# EAGLE schematic rom (EAGLE 6.5.0)
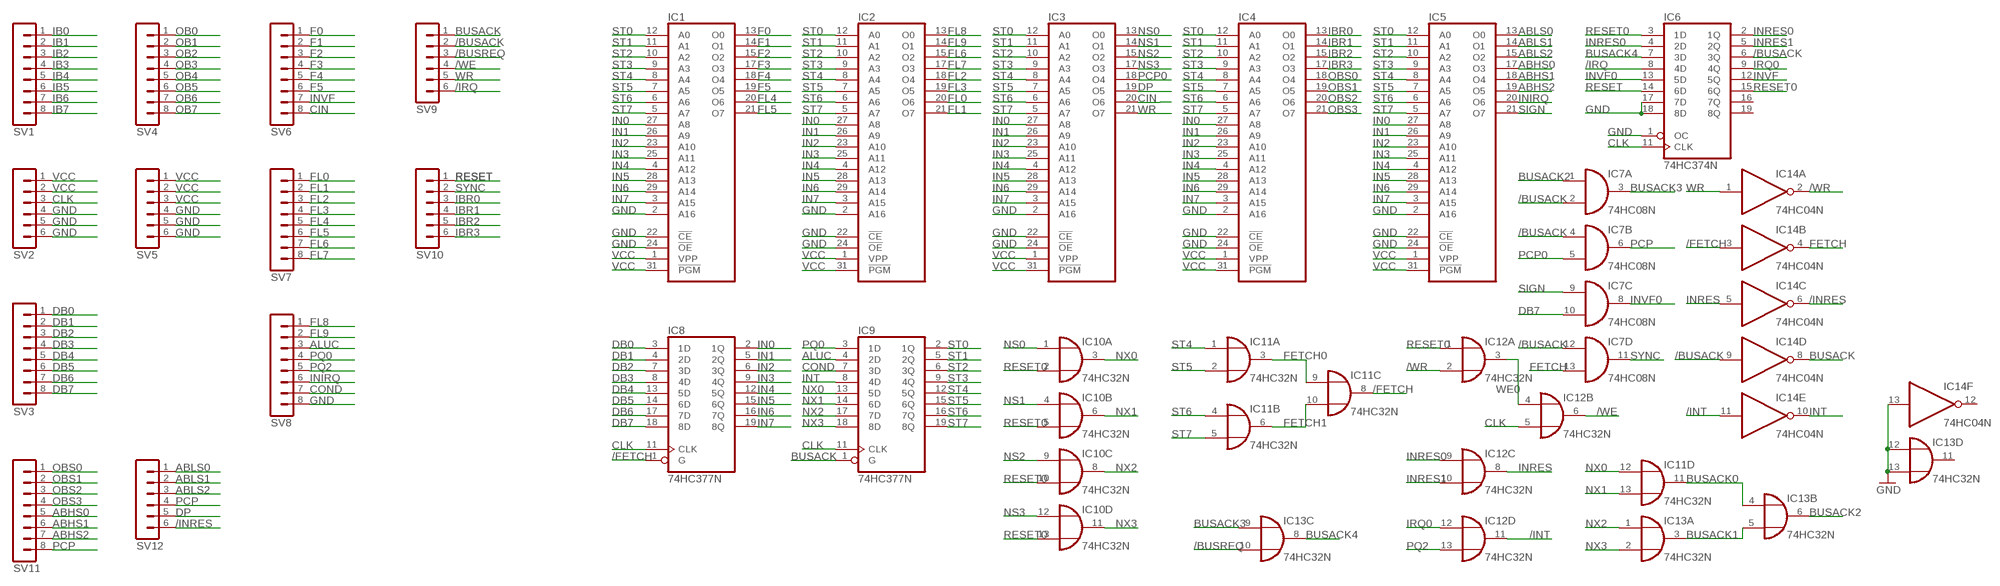
[diagram p0: schematic, sheet 1]

## Parts
IC1  27010  [DIL32]
IC2  27010  [DIL32]
IC3  27010  [DIL32]
IC4  27010  [DIL32]
IC5  27010  [DIL32]
IC6  74HC374N  [DIL20]
IC7  74HC08N  [DIL14]
IC8  74HC377N  [DIL20]
IC9  74HC377N  [DIL20]
IC10  74HC32N  [DIL14]
IC11  74HC32N  [DIL14]
IC12  74HC32N  [DIL14]
IC13  74HC32N  [DIL14]
IC14  74HC04N  [DIL14]
SV1  MA08-1  [MA08-1]
SV2  MA06-1  [MA06-1]
SV3  MA08-1  [MA08-1]
SV4  MA08-1  [MA08-1]
SV5  MA06-1  [MA06-1]
SV6  MA08-1  [MA08-1]
SV7  MA08-1  [MA08-1]
SV8  MA08-1  [MA08-1]
SV9  MA06-1  [MA06-1]
SV10  MA06-1  [MA06-1]
SV11  MA08-1  [MA08-1]
SV12  MA06-1  [MA06-1]

## Nets
/BUSACK: IC6.6(3Q) IC7.2(A:I1) IC7.4(B:I0) IC7.12(D:I0) IC14.9(D:I) SV9.2
/BUSREQ: IC13.10(C:I1) SV9.3
/FETCH: IC8.1(G) IC11.8(C:O) IC14.3(B:I)
/INRES: IC14.6(C:O) SV12.6
/INT: IC12.11(D:O) IC14.11(E:I)
/IRQ: IC6.8(4D) SV9.6
/WE: IC12.6(B:O) SV9.4
/WR: IC12.2(A:I1) IC14.2(A:O)
ABHS0: IC5.17(O3) SV11.5
ABHS1: IC5.18(O4) SV11.6
ABHS2: IC5.19(O5) SV11.7
ABLS0: IC5.13(O0) SV12.1
ABLS1: IC5.14(O1) SV12.2
ABLS2: IC5.15(O2) SV12.3
ALUC: IC9.4(2D) SV8.3
BUSACK: IC9.1(G) IC14.8(D:O) SV9.1
BUSACK0: IC11.11(D:O) IC13.4(B:I0)
BUSACK1: IC13.3(A:O) IC13.5(B:I1)
BUSACK2: IC7.1(A:I0) IC13.6(B:O)
BUSACK3: IC7.3(A:O) IC13.9(C:I0)
BUSACK4: IC6.7(3D) IC13.8(C:O)
CIN: IC3.20(O6) SV6.8
CLK: IC6.11(CLK) IC8.11(CLK) IC9.11(CLK) IC12.5(B:I1) SV2.3
COND: IC9.7(3D) SV8.7
DB0: IC8.3(1D) SV3.1
DB1: IC8.4(2D) SV3.2
DB2: IC8.7(3D) SV3.3
DB3: IC8.8(4D) SV3.4
DB4: IC8.13(5D) SV3.5
DB5: IC8.14(6D) SV3.6
DB6: IC8.17(7D) SV3.7
DB7: IC7.10(C:I1) IC8.18(8D) SV3.8
DP: IC3.19(O5) SV12.5
F0: IC1.13(O0) SV6.1
F1: IC1.14(O1) SV6.2
F2: IC1.15(O2) SV6.3
F3: IC1.17(O3) SV6.4
F4: IC1.18(O4) SV6.5
F5: IC1.19(O5) SV6.6
FETCH: IC7.13(D:I1) IC14.4(B:O)
FETCH0: IC11.3(A:O) IC11.9(C:I0)
FETCH1: IC11.6(B:O) IC11.10(C:I1)
FL0: IC2.20(O6) SV7.1
FL1: IC2.21(O7) SV7.2
FL2: IC2.18(O4) SV7.3
FL3: IC2.19(O5) SV7.4
FL4: IC1.20(O6) SV7.5
FL5: IC1.21(O7) SV7.6
FL6: IC2.15(O2) SV7.7
FL7: IC2.17(O3) SV7.8
FL8: IC2.13(O0) SV8.1
FL9: IC2.14(O1) SV8.2
GND: IC1.2(A16) IC1.22(!CE) IC1.24(!OE) IC2.2(A16) IC2.22(!CE) IC2.24(!OE) IC3.2(A16) IC3.22(!CE) IC3.24(!OE) IC4.2(A16) IC4.22(!CE) IC4.24(!OE) IC5.2(A16) IC5.22(!CE) IC5.24(!OE) IC6.1(OC) IC6.17(7D) IC6.18(8D) IC13.12(D:I0) IC13.13(D:I1) IC14.13(F:I) SV2.4 SV2.5 SV2.6 SV5.4 SV5.5 SV5.6 SV8.8
IB0: SV1.1
IB1: SV1.2
IB2: SV1.3
IB3: SV1.4
IB4: SV1.5
IB5: SV1.6
IB6: SV1.7
IB7: SV1.8
IBR0: IC4.13(O0) SV10.3
IBR1: IC4.14(O1) SV10.4
IBR2: IC4.15(O2) SV10.5
IBR3: IC4.17(O3) SV10.6
IN0: IC1.27(A8) IC2.27(A8) IC3.27(A8) IC4.27(A8) IC5.27(A8) IC8.2(1Q)
IN1: IC1.26(A9) IC2.26(A9) IC3.26(A9) IC4.26(A9) IC5.26(A9) IC8.5(2Q)
IN2: IC1.23(A10) IC2.23(A10) IC3.23(A10) IC4.23(A10) IC5.23(A10) IC8.6(3Q)
IN3: IC1.25(A11) IC2.25(A11) IC3.25(A11) IC4.25(A11) IC5.25(A11) IC8.9(4Q)
IN4: IC1.4(A12) IC2.4(A12) IC3.4(A12) IC4.4(A12) IC5.4(A12) IC8.12(5Q)
IN5: IC1.28(A13) IC2.28(A13) IC3.28(A13) IC4.28(A13) IC5.28(A13) IC8.15(6Q)
IN6: IC1.29(A14) IC2.29(A14) IC3.29(A14) IC4.29(A14) IC5.29(A14) IC8.16(7Q)
IN7: IC1.3(A15) IC2.3(A15) IC3.3(A15) IC4.3(A15) IC5.3(A15) IC8.19(8Q)
INIRQ: IC5.20(O6) SV8.6
INRES: IC12.8(C:O) IC14.5(C:I)
INRES0: IC6.2(1Q) IC6.4(2D) IC12.9(C:I0)
INRES1: IC6.5(2Q) IC12.10(C:I1)
INT: IC9.8(4D) IC14.10(E:O)
INVF: IC6.12(5Q) SV6.7
INVF0: IC6.13(5D) IC7.8(C:O)
IRQ0: IC6.9(4Q) IC12.12(D:I0)
NS0: IC3.13(O0) IC10.1(A:I0)
NS1: IC3.14(O1) IC10.4(B:I0)
NS2: IC3.15(O2) IC10.9(C:I0)
NS3: IC3.17(O3) IC10.12(D:I0)
NX0: IC9.13(5D) IC10.3(A:O) IC11.12(D:I0)
NX1: IC9.14(6D) IC10.6(B:O) IC11.13(D:I1)
NX2: IC9.17(7D) IC10.8(C:O) IC13.1(A:I0)
NX3: IC9.18(8D) IC10.11(D:O) IC13.2(A:I1)
OB0: SV4.1
OB1: SV4.2
OB2: SV4.3
OB3: SV4.4
OB4: SV4.5
OB5: SV4.6
OB6: SV4.7
OB7: SV4.8
OBS0: IC4.18(O4) SV11.1
OBS1: IC4.19(O5) SV11.2
OBS2: IC4.20(O6) SV11.3
OBS3: IC4.21(O7) SV11.4
PCP: IC7.6(B:O) SV11.8 SV12.4
PCP0: IC3.18(O4) IC7.5(B:I1)
PQ0: IC9.3(1D) SV8.4
PQ2: IC12.13(D:I1) SV8.5
RESET: IC6.14(6D) SV10.1
RESET0: IC6.3(1D) IC6.15(6Q) IC10.2(A:I1) IC10.5(B:I1) IC10.10(C:I1) IC10.13(D:I1) IC12.1(A:I0)
SIGN: IC5.21(O7) IC7.9(C:I0)
ST0: IC1.12(A0) IC2.12(A0) IC3.12(A0) IC4.12(A0) IC5.12(A0) IC9.2(1Q)
ST1: IC1.11(A1) IC2.11(A1) IC3.11(A1) IC4.11(A1) IC5.11(A1) IC9.5(2Q)
ST2: IC1.10(A2) IC2.10(A2) IC3.10(A2) IC4.10(A2) IC5.10(A2) IC9.6(3Q)
ST3: IC1.9(A3) IC2.9(A3) IC3.9(A3) IC4.9(A3) IC5.9(A3) IC9.9(4Q)
ST4: IC1.8(A4) IC2.8(A4) IC3.8(A4) IC4.8(A4) IC5.8(A4) IC9.12(5Q) IC11.1(A:I0)
ST5: IC1.7(A5) IC2.7(A5) IC3.7(A5) IC4.7(A5) IC5.7(A5) IC9.15(6Q) IC11.2(A:I1)
ST6: IC1.6(A6) IC2.6(A6) IC3.6(A6) IC4.6(A6) IC5.6(A6) IC9.16(7Q) IC11.4(B:I0)
ST7: IC1.5(A7) IC2.5(A7) IC3.5(A7) IC4.5(A7) IC5.5(A7) IC9.19(8Q) IC11.5(B:I1)
SYNC: IC7.11(D:O) SV10.2
VCC: IC1.1(VPP) IC1.31(!PGM) IC2.1(VPP) IC2.31(!PGM) IC3.1(VPP) IC3.31(!PGM) IC4.1(VPP) IC4.31(!PGM) IC5.1(VPP) IC5.31(!PGM) SV2.1 SV2.2 SV5.1 SV5.2 SV5.3
WE0: IC12.3(A:O) IC12.4(B:I0)
WR: IC3.21(O7) IC14.1(A:I) SV9.5
Unconnected: IC6.16(7Q) IC6.19(8Q) IC13.11(D:O) IC14.12(F:O)

## Power pins joined to a net without a drawn wire
GND: IC1.16(GND) IC2.16(GND) IC3.16(GND) IC4.16(GND) IC5.16(GND) IC6.10(GND) IC7.7(P:GND) IC8.10(GND) IC9.10(GND) IC10.7(P:GND) IC11.7(P:GND) IC12.7(P:GND) IC13.7(P:GND) IC14.7(P:GND)
VCC: IC1.32(VCC) IC2.32(VCC) IC3.32(VCC) IC4.32(VCC) IC5.32(VCC) IC6.20(VCC) IC7.14(P:VCC) IC8.20(VCC) IC9.20(VCC) IC10.14(P:VCC) IC11.14(P:VCC) IC12.14(P:VCC) IC13.14(P:VCC) IC14.14(P:VCC)

## Library data of the parts
IC1-IC5 = memory:27010: MEMORY
IC6 = 74xx-eu:74*374: Octal D type transparent LATCH, edge triggered
IC7 = 74xx-eu:74*08: Quad 2-input AND gate
IC8 IC9 = 74xx-eu:74*377: Octal D type FLIP FLOP, enable
IC10-IC13 = 74xx-eu:74*32: Quad 2-input OR gate
IC14 = 74xx-eu:74*04: Hex INVERTER
SV1 SV3 SV4 SV6-SV8 SV11 = con-lstb:MA08-1: PIN HEADER; OC_FARNELL: unknown; OC_NEWARK: unknown
SV2 SV5 SV9 SV10 SV12 = con-lstb:MA06-1: PIN HEADER; OC_FARNELL: unknown; OC_NEWARK: unknown